# Altium schematic sheet Microcontroller.SchDoc
size A4
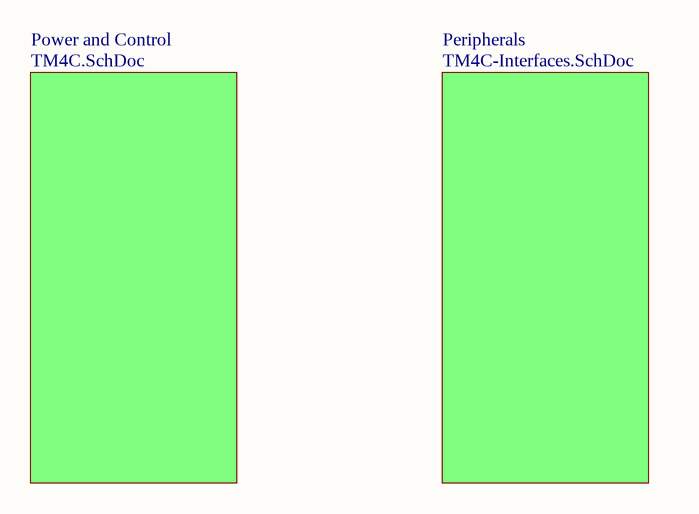
[diagram p0: Microcontroller.SchDoc]

## Sub-sheets
Peripherals = TM4C-Interfaces.SchDoc: no entries
Power and Control = TM4C.SchDoc: no entries

## Notes on the sheet
- Title
- Size:
- Date:
- Engineer
- A4
- Number:
- Sheet
- of
- Approved
- Revision:
- UC Riverside
- www.highlanderracing.org <https://www.highlanderracing.org>
- File: